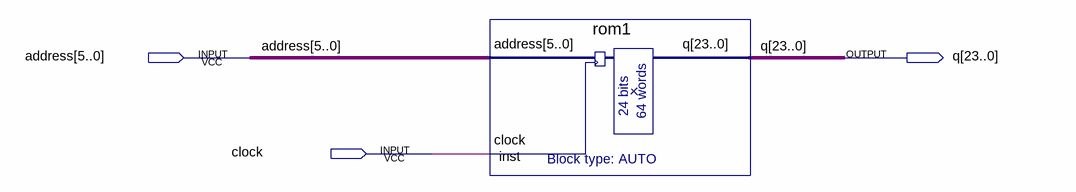
[diagram p0: schematic sheet]
// Quartus schematic experiment7.bdf as structural Verilog: 1 symbols, 3 pins
module experiment7 (
  input  [5:0] address,
  input  clock,
  output [23:0] q
);

  rom1 inst (.address(address), .clock(clock), .q(q));
endmodule
